# Altium schematic sheet STM32F4.SchDoc
size A
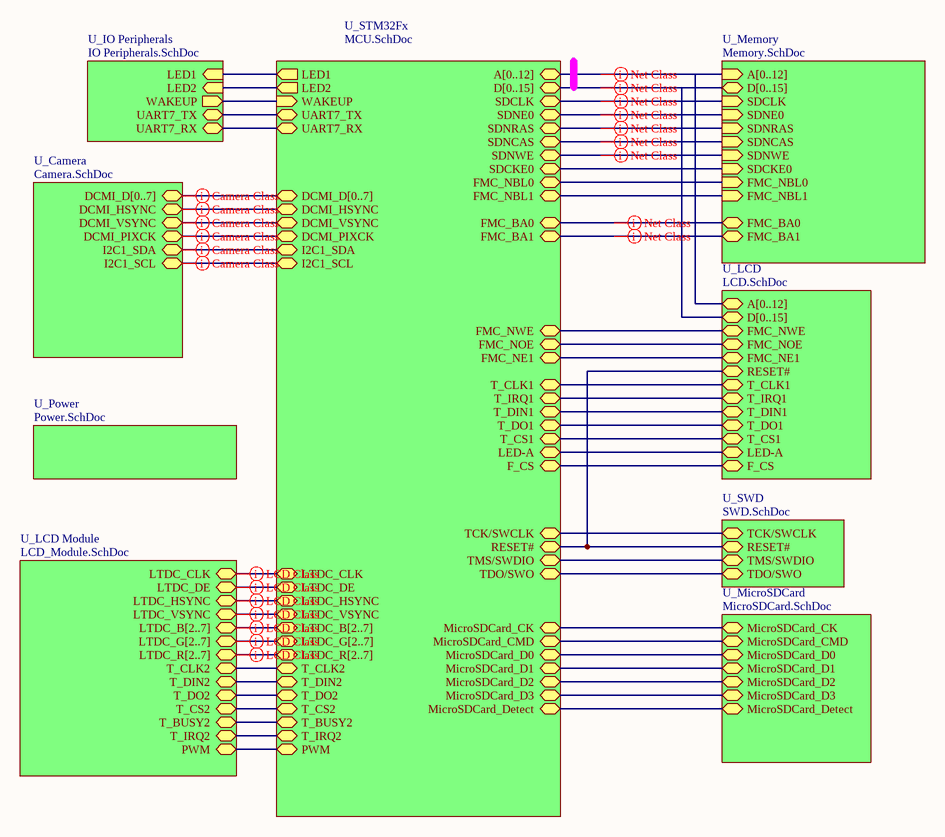
[diagram p0: STM32F4.SchDoc]

## Sub-sheets
U_Camera = Camera.SchDoc: DCMI_D[0..7], DCMI_HSYNC, DCMI_VSYNC, DCMI_PIXCK, I2C1_SDA, I2C1_SCL
U_IO Peripherals = IO Peripherals.SchDoc: LED1 (in), LED2 (in), WAKEUP (out), UART7_TX, UART7_RX
U_LCD = LCD.SchDoc: T_CLK1, T_IRQ1, T_DIN1, T_DO1, T_CS1, D[0..15], A[0..12], FMC_NE1, FMC_NWE, FMC_NOE, LED-A, RESET#, F_CS
U_LCD Module = LCD_Module.SchDoc: LTDC_DE, LTDC_HSYNC, LTDC_CLK, LTDC_VSYNC, LTDC_B[2..7], LTDC_G[2..7], LTDC_R[2..7], T_CLK2, T_DIN2, T_DO2, T_CS2, T_BUSY2, T_IRQ2, PWM
U_Memory = Memory.SchDoc: FMC_NBL0 (in), FMC_NBL1 (in), D[0..15] (bidir), A[0..12] (in), SDNCAS (in), SDNWE (in), SDNRAS (in), SDNE0 (in), SDCKE0 (in), SDCLK (in), FMC_BA0, FMC_BA1
U_MicroSDCard = MicroSDCard.SchDoc: MicroSDCard_CK, MicroSDCard_CMD, MicroSDCard_D0, MicroSDCard_D1, MicroSDCard_D2, MicroSDCard_D3, MicroSDCard_Detect
U_Power = Power.SchDoc: no entries
U_STM32Fx = MCU.SchDoc: A[0..12], D[0..15], SDCLK, SDNE0, SDNRAS, SDNCAS, SDNWE, TCK/SWCLK, RESET#, TMS/SWDIO, TDO/SWO, T_CLK1, T_IRQ1, T_DIN1, T_DO1, T_CS1, LED-A, MicroSDCard_CMD, MicroSDCard_CK, MicroSDCard_D0, MicroSDCard_D3, MicroSDCard_D1, MicroSDCard_D2, MicroSDCard_Detect, FMC_NE1, LED1 (out), LED2 (out), WAKEUP (in), F_CS, SDCKE0, FMC_NBL0, FMC_NBL1, FMC_NWE, FMC_NOE, LTDC_DE, LTDC_HSYNC, LTDC_CLK, LTDC_VSYNC, LTDC_B[2..7], LTDC_G[2..7], LTDC_R[2..7], T_CLK2, T_DIN2, T_DO2, T_CS2, T_BUSY2, T_IRQ2, PWM, FMC_BA0, FMC_BA1, DCMI_D[0..7], DCMI_HSYNC, DCMI_VSYNC, DCMI_PIXCK, I2C1_SDA, I2C1_SCL, UART7_TX, UART7_RX
U_SWD = SWD.SchDoc: TCK/SWCLK, TMS/SWDIO, RESET#, TDO/SWO

## Nets
(unnamed): sheet U_STM32Fx/SDCLK, sheet U_Memory/SDCLK
(unnamed): sheet U_STM32Fx/SDNE0, sheet U_Memory/SDNE0
(unnamed): sheet U_STM32Fx/SDNRAS, sheet U_Memory/SDNRAS
(unnamed): sheet U_STM32Fx/SDNCAS, sheet U_Memory/SDNCAS
(unnamed): sheet U_STM32Fx/SDNWE, sheet U_Memory/SDNWE
(unnamed): sheet U_STM32Fx/TCK/SWCLK, sheet U_SWD/TCK/SWCLK
(unnamed): sheet U_STM32Fx/RESET#, sheet U_SWD/RESET#, sheet U_LCD/RESET#
(unnamed): sheet U_STM32Fx/TMS/SWDIO, sheet U_SWD/TMS/SWDIO
(unnamed): sheet U_STM32Fx/TDO/SWO, sheet U_SWD/TDO/SWO
(unnamed): sheet U_STM32Fx/T_CLK1, sheet U_LCD/T_CLK1
(unnamed): sheet U_STM32Fx/T_IRQ1, sheet U_LCD/T_IRQ1
(unnamed): sheet U_STM32Fx/T_DIN1, sheet U_LCD/T_DIN1
(unnamed): sheet U_STM32Fx/T_DO1, sheet U_LCD/T_DO1
(unnamed): sheet U_STM32Fx/T_CS1, sheet U_LCD/T_CS1
(unnamed): sheet U_STM32Fx/LED-A, sheet U_LCD/LED-A
(unnamed): sheet U_STM32Fx/MicroSDCard_CMD, sheet U_MicroSDCard/MicroSDCard_CMD
(unnamed): sheet U_STM32Fx/MicroSDCard_CK, sheet U_MicroSDCard/MicroSDCard_CK
(unnamed): sheet U_STM32Fx/MicroSDCard_D0, sheet U_MicroSDCard/MicroSDCard_D0
(unnamed): sheet U_STM32Fx/MicroSDCard_D3, sheet U_MicroSDCard/MicroSDCard_D3
(unnamed): sheet U_STM32Fx/MicroSDCard_D1, sheet U_MicroSDCard/MicroSDCard_D1
(unnamed): sheet U_STM32Fx/MicroSDCard_D2, sheet U_MicroSDCard/MicroSDCard_D2
(unnamed): sheet U_STM32Fx/MicroSDCard_Detect, sheet U_MicroSDCard/MicroSDCard_Detect
(unnamed): sheet U_STM32Fx/FMC_NE1, sheet U_LCD/FMC_NE1
(unnamed): sheet U_STM32Fx/LED1, sheet U_IO Peripherals/LED1
(unnamed): sheet U_STM32Fx/LED2, sheet U_IO Peripherals/LED2
(unnamed): sheet U_STM32Fx/WAKEUP, sheet U_IO Peripherals/WAKEUP
(unnamed): sheet U_STM32Fx/F_CS, sheet U_LCD/F_CS
(unnamed): sheet U_STM32Fx/SDCKE0, sheet U_Memory/SDCKE0
(unnamed): sheet U_STM32Fx/FMC_NBL0, sheet U_Memory/FMC_NBL0
(unnamed): sheet U_STM32Fx/FMC_NBL1, sheet U_Memory/FMC_NBL1
(unnamed): sheet U_STM32Fx/FMC_NWE, sheet U_LCD/FMC_NWE
(unnamed): sheet U_STM32Fx/FMC_NOE, sheet U_LCD/FMC_NOE
(unnamed): sheet U_STM32Fx/LTDC_DE, sheet U_LCD Module/LTDC_DE
(unnamed): sheet U_STM32Fx/LTDC_HSYNC, sheet U_LCD Module/LTDC_HSYNC
(unnamed): sheet U_STM32Fx/LTDC_CLK, sheet U_LCD Module/LTDC_CLK
(unnamed): sheet U_STM32Fx/LTDC_VSYNC, sheet U_LCD Module/LTDC_VSYNC
(unnamed): sheet U_STM32Fx/T_CLK2, sheet U_LCD Module/T_CLK2
(unnamed): sheet U_STM32Fx/T_DIN2, sheet U_LCD Module/T_DIN2
(unnamed): sheet U_STM32Fx/T_DO2, sheet U_LCD Module/T_DO2
(unnamed): sheet U_STM32Fx/T_CS2, sheet U_LCD Module/T_CS2
(unnamed): sheet U_STM32Fx/T_BUSY2, sheet U_LCD Module/T_BUSY2
(unnamed): sheet U_STM32Fx/T_IRQ2, sheet U_LCD Module/T_IRQ2
(unnamed): sheet U_STM32Fx/PWM, sheet U_LCD Module/PWM
(unnamed): sheet U_STM32Fx/FMC_BA0, sheet U_Memory/FMC_BA0
(unnamed): sheet U_STM32Fx/FMC_BA1, sheet U_Memory/FMC_BA1
(unnamed): sheet U_STM32Fx/DCMI_HSYNC, sheet U_Camera/DCMI_HSYNC
(unnamed): sheet U_STM32Fx/DCMI_VSYNC, sheet U_Camera/DCMI_VSYNC
(unnamed): sheet U_STM32Fx/DCMI_PIXCK, sheet U_Camera/DCMI_PIXCK
(unnamed): sheet U_STM32Fx/I2C1_SDA, sheet U_Camera/I2C1_SDA
(unnamed): sheet U_STM32Fx/I2C1_SCL, sheet U_Camera/I2C1_SCL
(unnamed): sheet U_STM32Fx/UART7_TX, sheet U_IO Peripherals/UART7_TX
(unnamed): sheet U_STM32Fx/UART7_RX, sheet U_IO Peripherals/UART7_RX

## Buses and harness runs
bus sheet U_Camera/DCMI_D[0..7] = sheet U_STM32Fx/DCMI_D[0..7]
bus sheet U_LCD Module/LTDC_B[2..7] = sheet U_STM32Fx/LTDC_B[2..7]
bus sheet U_LCD Module/LTDC_G[2..7] = sheet U_STM32Fx/LTDC_G[2..7]
bus sheet U_LCD Module/LTDC_R[2..7] = sheet U_STM32Fx/LTDC_R[2..7]
bus sheet U_LCD/A[0..12] = sheet U_Memory/A[0..12] = sheet U_STM32Fx/A[0..12]
bus sheet U_LCD/D[0..15] = sheet U_Memory/D[0..15] = sheet U_STM32Fx/D[0..15]

## Layout directives
net class Same Length: (no net found under the mark)
net class LCD Class: (no net found under the mark)
net class Camera Class: (no net found under the mark)